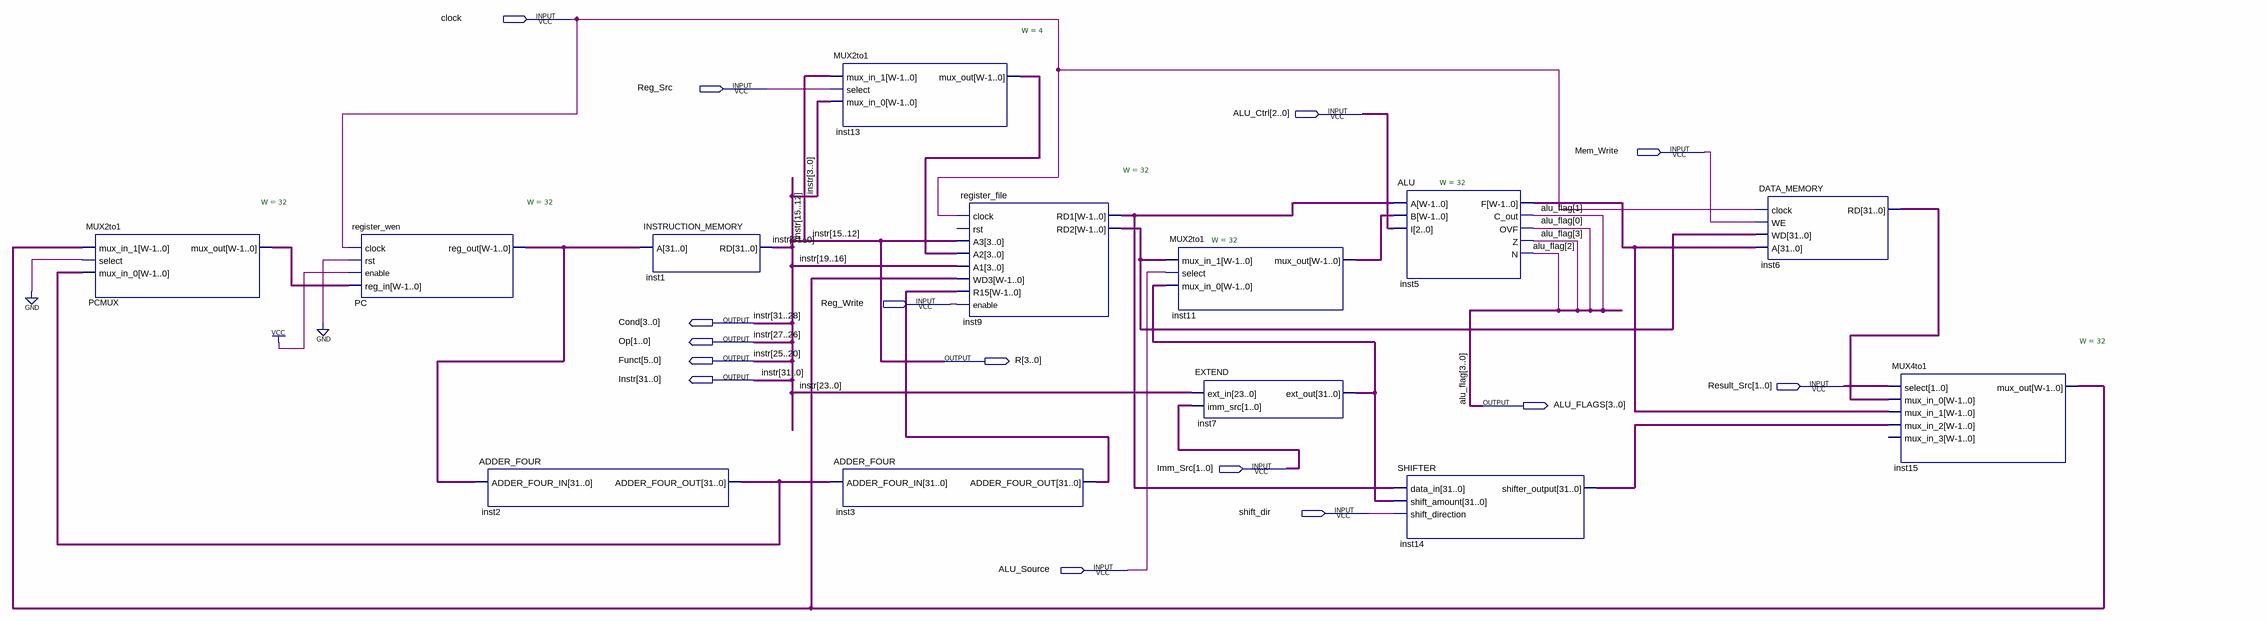
[diagram p0: schematic sheet]
// Quartus schematic Single_Cycle_Datapath.bdf as structural Verilog: 13 symbols, 15 pins
module Single_Cycle_Datapath (
  input  clock,
  input  Reg_Src,
  input  [2:0] ALU_Ctrl,
  input  Mem_Write,
  input  Reg_Write,
  input  [1:0] Result_Src,
  input  [1:0] Imm_Src,
  input  shift_dir,
  input  ALU_Source,
  output [3:0] Cond,
  output [1:0] Op,
  output [5:0] Funct,
  output [3:0] R,
  output [31:0] Instr,
  output [3:0] ALU_FLAGS
);

  wire [3:0] inst13_mux_out;
  wire [31:0] inst2_adder_four_out, inst3_adder_four_out, inst5_f, inst6_rd, inst7_ext_out, inst9_rd1,
       inst9_rd2, inst11_mux_out, inst14_shifter_output, inst15_mux_out, PC_reg_out, PCMUX_mux_out;

  MUX2to1 #(.W(32)) PCMUX (
    .mux_in_1(inst15_mux_out), .select(1'b0), .mux_in_0(inst2_adder_four_out), .mux_out(PCMUX_mux_out));
  register_wen #(.W(32)) PC (.clock(clock), .rst(1'b0), .enable(1'b1), .reg_in(PCMUX_mux_out), .reg_out(PC_reg_out));
  ADDER_FOUR inst2 (.ADDER_FOUR_IN(PC_reg_out), .ADDER_FOUR_OUT(inst2_adder_four_out));
  INSTRUCTION_MEMORY inst1 (.A(PC_reg_out), .RD({Cond, Instr[27:26], Funct, Instr[19:0]}));
  MUX2to1 #(.W(4)) inst13 (.mux_in_1(Instr[15:12]), .select(Reg_Src), .mux_in_0(Instr[3:0]), .mux_out(inst13_mux_out));
  ADDER_FOUR inst3 (.ADDER_FOUR_IN(inst2_adder_four_out), .ADDER_FOUR_OUT(inst3_adder_four_out));
  register_file #(.W(32)) inst9 (
    .clock(clock), .A3(Instr[15:12]), .A2(inst13_mux_out), .A1(Instr[19:16]), .WD3(inst15_mux_out),
    .R15(inst3_adder_four_out), .enable(Reg_Write), .RD1(inst9_rd1), .RD2(inst9_rd2));  // open: rst
  MUX2to1 #(.W(32)) inst11 (
    .mux_in_1(inst9_rd2), .select(ALU_Source), .mux_in_0(inst7_ext_out), .mux_out(inst11_mux_out));
  EXTEND inst7 (.ext_in({Funct[3:0], Instr[19:0]}), .imm_src(Imm_Src), .ext_out(inst7_ext_out));
  ALU #(.W(32)) inst5 (
    .A(inst9_rd1), .B(inst11_mux_out), .I(ALU_Ctrl), .F(inst5_f), .C_out(ALU_FLAGS[1]), .OVF(ALU_FLAGS[0]),
    .Z(ALU_FLAGS[3]), .N(ALU_FLAGS[2]));
  SHIFTER inst14 (
    .data_in(inst9_rd1), .shift_amount(inst7_ext_out), .shift_direction(shift_dir),
    .shifter_output(inst14_shifter_output));
  DATA_MEMORY inst6 (.clock(clock), .WE(Mem_Write), .WD(inst9_rd2), .A(inst5_f), .RD(inst6_rd));
  MUX4to1 #(.W(32)) inst15 (
    .select(Result_Src), .mux_in_0(inst6_rd), .mux_in_1(inst5_f), .mux_in_2(inst14_shifter_output),
    .mux_out(inst15_mux_out));  // open: mux_in_3

  assign {Instr[31:28], Instr[25:20]} = {Cond, Funct};
  assign Op = Instr[27:26];
  assign R = Instr[15:12];

  // Other names for the same wires on the sheet: alu_flag[3:0] = ALU_FLAGS
endmodule
